# EAGLE design CP Sapling (EAGLE 9.5.2)
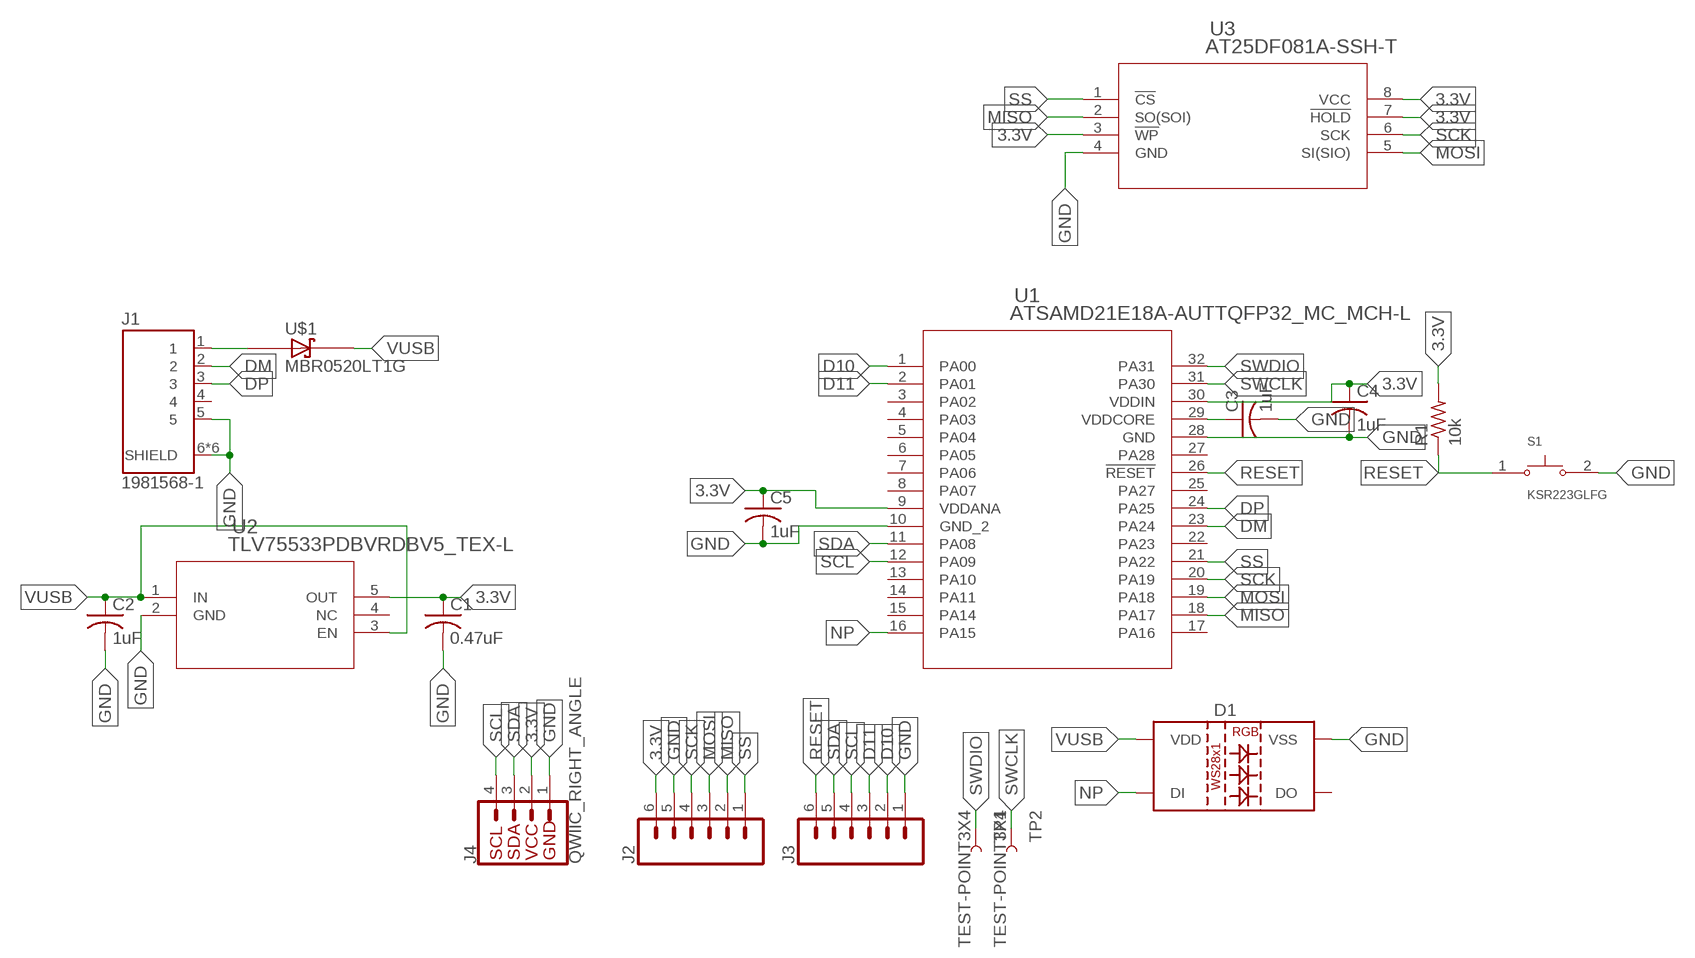
[diagram p0: schematic, sheet 1]

## Parts
C1  0.47uF  C-USC0402  [C0402]
C2  1uF  C-USC0402  [C0402]
C3  1uF  C-USC0402  [C0402]
C4  1uF  C-USC0402  [C0402]
C5  1uF  C-USC0402  [C0402]
D1  WS2812B  WS2812BWS2812B-3535  [WS2812B-3535]
J1  1981568-1  [TE_1981568-1]
J2  CONN_06NO_SILK_NO_POP  [1X06_NO_SILK]
J3  CONN_06NO_SILK_NO_POP  [1X06_NO_SILK]
J4  QWIIC_RIGHT_ANGLE  QWIIC_CONNECTORJS-1MM  [JST04_1MM_RA]
R1  10k  R-US_R0402  [R0402]
S1  KSR223GLFG  [SW_KSR223GLFG]
TP1  TEST-POINT3X4  [PAD.03X.04]
TP2  TEST-POINT3X4  [PAD.03X.04]
U1  ATSAMD21E18A-AUTTQFP32_MC_MCH-L  [TQFP32_MC_MCH-L]
U2  TLV75533PDBVRDBV5_TEX-L  [DBV5_TEX-L]
U3  AT25DF081A-SSH-T  [SOIC_AT25DF081_ADO]
U$1  MBR0520LT1G  [SOD3716X117(SOD-123)]

## Nets
3.3V: C1.1 C4.1 C5.1 J2.6 J4.2 R1.2 U1.9(VDDANA) U1.30(VDDIN) U2.5(OUT) U3.3(!WP) U3.7(!HOLD) U3.8(VCC)
D10: J3.2 U1.1(PA00)
D11: J3.3 U1.2(PA01)
DM: J1.2 U1.23(PA24)
DP: J1.3 U1.24(PA25)
GND: C1.2 C2.2 C3.2 C4.2 C5.2 D1.3(VSS) J1.5 J1.6(SHIELD) J1.7(SHIELD) J1.8(SHIELD) J1.9(SHIELD) J1.10(SHIELD) J1.11(SHIELD) J2.5 J3.1 J4.1 S1.2 U1.10(GND_2) U1.28(GND) U2.2(GND) U3.4(GND)
MISO: J2.2 U1.18(PA17) U3.2(SO(SOI))
MOSI: J2.3 U1.19(PA18) U3.5(SI(SIO))
N$1: J1.1 U$1.2(A)
N$4: C3.1 U1.29(VDDCORE)
NP: D1.4(DI) U1.16(PA15)
RESET: J3.6 R1.1 S1.1 U1.26(!RESET)
SCK: J2.4 U1.20(PA19) U3.6(SCK)
SCL: J3.4 J4.4 U1.12(PA09)
SDA: J3.5 J4.3 U1.11(PA08)
SS: J2.1 U1.21(PA22) U3.1(!CS)
SWCLK: TP2.P$1 U1.31(PA30)
SWDIO: TP1.P$1 U1.32(PA31)
VUSB: C2.1 D1.1(VDD) U2.1(IN) U2.3(EN) U$1.1(C)
Unconnected: D1.2(DO) J1.4 U1.3(PA02) U1.4(PA03) U1.5(PA04) U1.6(PA05) U1.7(PA06) U1.8(PA07) U1.13(PA10) U1.14(PA11) U1.15(PA14) U1.17(PA16) U1.22(PA23) U1.25(PA27) U1.27(PA28) U2.4(NC)

## Library data of the parts
C1-C5 = rcl:C-US: CAPACITOR, American symbol; SPICEPREFIX: C
D1 = SparkFun-LED:WS2812B: WS2812B SMD addressable RGB LED 5x5mm SMD LED with built-in controller IC. Color: Red/Green/Blue mC Rating: RGB: 390, 660, 180 mcd Forward Voltage: RGB: 2.0, 3.0, 3.0 V Packages:WS2812B SparkFun Products: Blynk Board - ESP8266 <https://www.sparkfun.com/products/13794>
J1 = 1981568-1:1981568-1: CONN RCPT MICRO USB B R/A SMD; AVAILABILITY: Unavailable; DESCRIPTION: USB - micro B USB 2.0 Receptacle Connector 5 Position Surface Mount, Right Angle; MF: TE Connectivity; MP: 19815681; PACKAGE: None; PRICE: None; TE_PURCHASE_URL: https://www.te.com/usa-en/product-19815681.html?te_bu=Cor&te_type=disp&te_campaign=seda_glo_cor-seda-global-disp-prtnr-fy19-seda-model-bom-cta_sma-317_1&elqCampaignId=32493
J2 J3 = SparkFun-Connectors:CONN_06: Multi connection point. Often used as Generic Header-pin footprint for 0.1 inch spaced/style header connections On any of the 0.1 inch spaced packages, you can populate with these: Break Away Headers - Straight <https://www.sparkfun.com/products/116> (PRT-00116) Break Away Male Headers - Right Angle <https://www.sparkfun.com/products/553> (PRT-00553) Female Headers <https://www.sparkfun.com/products/115> (PRT-00115) Break Away Headers - Machine Pin <https://www.sparkfun.com/products/117> (PRT-00117) Break Away Female Headers - Swiss Machine Pin <https://www.sparkfun.com/products/743> (PRT-00743) Arduino Stackable Header - 6 Pin <https://www.sparkfun.com/products/9280> (PRT-09280) For SCREWTERMINALS and SPRING TERMINALS visit here: Screw Terimnals on SparkFun.com <https://www.sparkfun.com/search/results?term=Screw+Terminals> (5mm/3.5mm/2.54mm spacing) This device is also useful as a general connection point to wire up your design to another part of your project. Our various solder wires solder well into these plated through hole pads. Hook-Up Wire - Assortment (Stranded, 22 AWG) <https://www.sparkfun.com/products/11375> (PRT-11375) Hook-Up Wire - Assortment (Solid Core, 22 AWG) <https://www.sparkfun.com/products/11367> (PRT-11367) View the entire wire category on our website here <https://www.sparkfun.com/categories/141>
J4 = SparkFun-Connectors:QWIIC_CONNECTOR: SparkFun I2C Standard Qwiic Connector An SMD 1mm pitch JST connector makes it easy and quick (get it? Qwiic?) to connect I2C devices to each other. The Qwiic system <http://www.sparkfun.com/qwiic> enables fast and solderless connection between popular platforms and various sensors and actuators. We carry 200mm <https://www.sparkfun.com/products/14204>, 100mm <https://www.sparkfun.com/products/14205>, 50mm <https://www.sparkfun.com/products/14206>, and breadboard friendly <https://www.sparkfun.com/products/14207> Qwiic cables. We also offer 10 pcs strips <https://www.sparkfun.com/products/14323> the SMD connectors.; PROD_ID: CONN-13694
R1 = rcl:R-US_: RESISTOR, American symbol; SPICEPREFIX: R
S1 = KSR223GLFG:KSR223GLFG: Switch Tactile N.O. SPST Round Button Gull Wing 0.01A 32VDC 0.2VA 200000Cycles 2N SMD Automotive T/R; AVAILABILITY: Unavailable; DESCRIPTION: Tactile Switch SPST-NO Top Actuated Surface Mount; MF: C&K; MP: KSR223GLFG; PACKAGE: None; PRICE: None
TP1 TP2 = SparkFun-Connectors:TEST-POINT: SparkFun Test Points Bare copper test points for troubleshooting or In-Circuit-Testing. These are used by our Production team for verifying production board runs using pogo-pins on test beds. SparkFun Products: SparkFun LSM9DS1 Breakout <https://www.sparkfun.com/products/13284> SparkFun PSOC <https://www.sparkfun.com/products/13714> SparkFun Load Cell Amplifier <https://www.sparkfun.com/products/13879>
U1 = ATSAMD21E18A-AUT:ATSAMD21E18A-AUT; BUILT_BY: EMA_Molly; COPYRIGHT: Copyright (C) 2018 Accelerated Designs. All rights reserved; MANUFACTURER_PART_NUMBER: ATSAMD21E18A-AUT; SOURCELIBRARY: Microchip_2019-08-23_25; VENDOR: Microchip
U2 = TLV75533pdbvr:TLV75533PDBVR; COPYRIGHT: Copyright (C) 2018 Accelerated Designs. All rights reserved; MANUFACTURER_PART_NUMBER: TLV75533PDBVR; SOURCELIBRARY: TI_2019-06-18; VENDOR: Texas Instruments
U3 = AT25DF081A-SSH-T:AT25DF081A-SSH-T; BUILT_BY: EMA_Matt; COPYRIGHT: Copyright (C) 2018 Accelerated Designs. All rights reserved; MANUFACTURER_PART_NUMBER: AT25DF081A-SSH-T; SOURCELIBRARY: Adesto_Technologies_10-16-2019; VENDOR: Adesto Technologies
U$1 = MBR0520LT1G:MBR0520LT1G: Surface Mount Schottky Power Rectifier Plastic SOD−123 Package; AVAILABILITY: Unavailable; DESCRIPTION: Diode Schottky 20V 500mA Surface Mount SOD-123; MF: ON Semiconductor; MP: MBR0520LT1G; PACKAGE: SOD-123 ON Semiconductor; PRICE: None

## Board
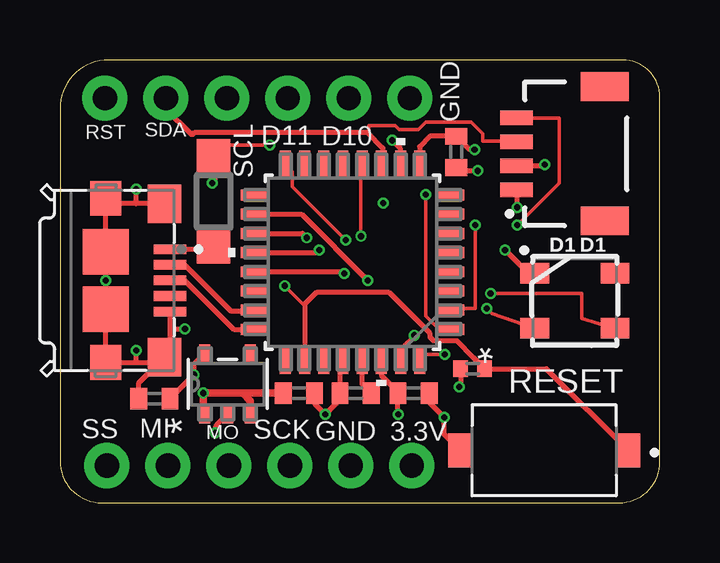
[diagram p1: board, top side]
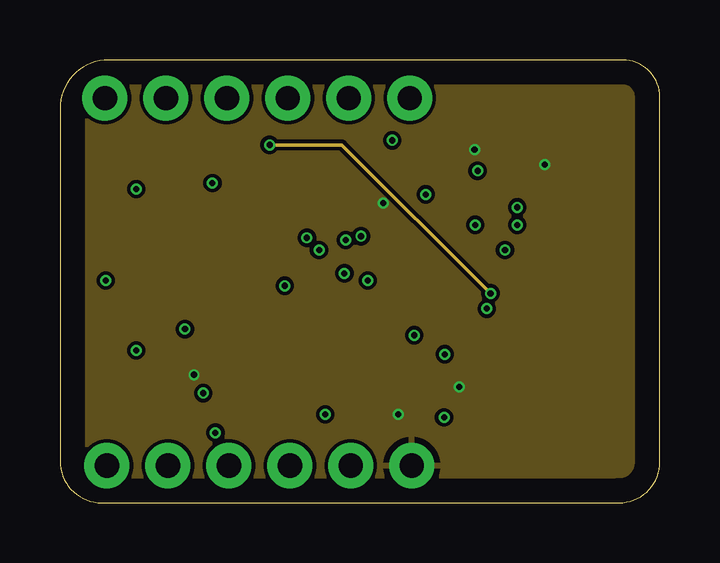
[diagram p2: board, inner layer Route2]
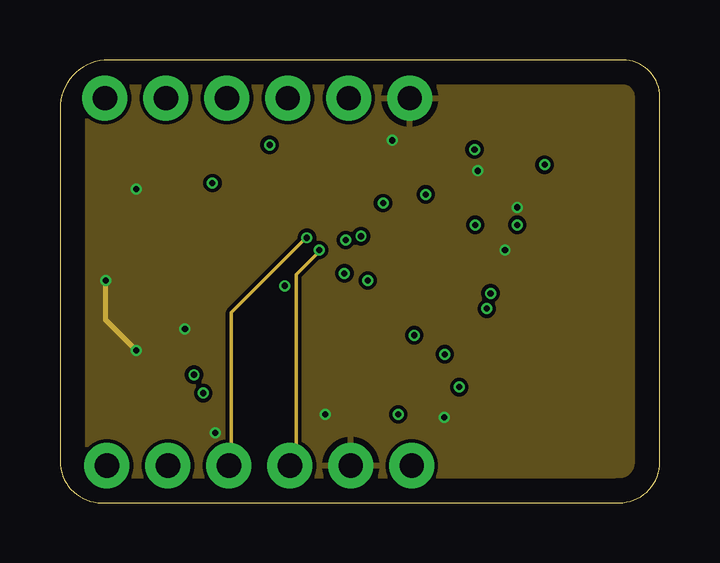
[diagram p3: board, inner layer Route15]
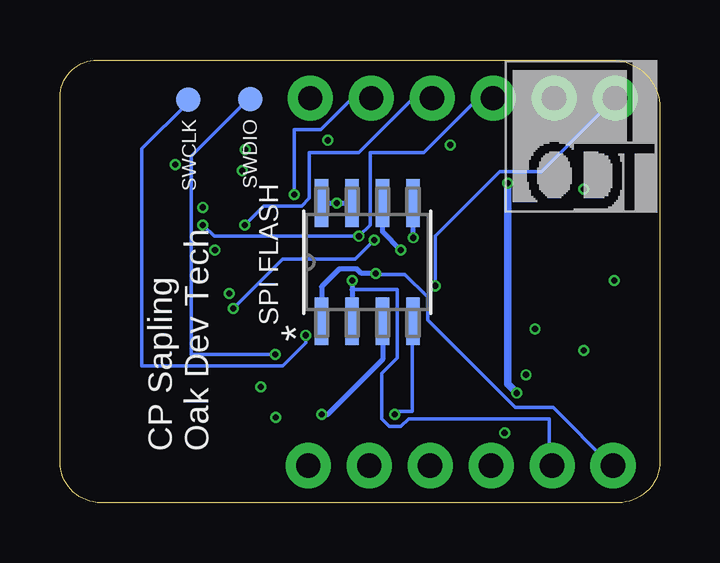
[diagram p4: board, bottom side, seen from below]

Size 25 x 18.47 mm. Coordinates in mm from the lower left corner, seen from the top.
Outline: 0,16.44 0,1.73 arc90 1.73,0 23.3,0 arc90 25,1.7 25,16.91 arc90 23.44,18.47 2.03,18.47 arc90 0,16.44
Copper layers (1+2*15+16): Top 0.035mm / dielectric 1.5mm / Route2 0.035mm / dielectric 0.15mm / Route15 0.035mm / dielectric 0.2mm / Bottom 0.035mm
Design rules "default *": minimum track width 6mil, minimum drill 10mil, track to track 6mil, track to pad 6mil, pad to pad 6mil, via to via 6mil, smd to smd 6mil, copper to edge 40mil, drill to drill 6mil, minimum pad ring 10mil, minimum via ring 4mil, stop-mask expansion 4mil, vias tented up to drill 20mil, thermal gap 10mil

### Footprints (pad centres in the part's own frame; a part is rotated, then mirrored left to right if it is on the bottom)
C0402 = smd 0.7 x 0.9: 1 -0.65,0; 2 0.65,0
WS2812B-3535 = smd 1.2 x 0.85: 1 0.923,-0.4; 2 0.923,1.9; 3 -2.423,1.9; 4 -2.423,-0.4
TE_1981568-1 = smd 0.4 x 1.35: 1 -1.3,2.675; 2 -0.65,2.675; 3 0,2.675; 4 0.65,2.675; 5 1.3,2.675 | smd 1.6 x 1.4: 6 -3.2,2.45; 7 3.2,2.45 | smd 1.45 x 1.3: 8 3.425,0; 9 -3.425,0 | smd 1.9 x 1.9: 10 -1.2,0; 11 1.2,0
1X06_NO_SILK = drill 1.016 pad 1.88: 1 0,0; 2 2.54,0; 3 5.08,0; 4 7.62,0; 5 10.16,0; 6 12.7,0
JST04_1MM_RA = smd 0.6 x 1.35: 1 -1.5,0; 2 -0.5,0; 3 0.5,0; 4 1.5,0 | smd 1.2 x 2: NC1 2.8,-3.675; NC2 -2.8,-3.675
R0402 = smd 0.6 x 0.7: 1 -0.5,0; 2 0.5,0
SW_KSR223GLFG = smd 1 x 1.4: 1 -3.5,0; 2 3.5,0
PAD.03X.04 = smd 1.016 x 1.016: P$1 0,0
TQFP32_MC_MCH-L = smd 1.168 x 0.457: 1 -4.068,2.8; 2 -4.068,2; 3 -4.068,1.2; 4 -4.068,0.4; 5 -4.068,-0.4; 6 -4.068,-1.2; 7 -4.068,-2; 8 -4.068,-2.8; 17 4.068,-2.8; 18 4.068,-2; 19 4.068,-1.2; 20 4.068,-0.4; 21 4.068,0.4; 22 4.068,1.2; 23 4.068,2; 24 4.068,2.8 | smd 0.457 x 1.168: 9 -2.8,-4.068; 10 -2,-4.068; 11 -1.2,-4.068; 12 -0.4,-4.068; 13 0.4,-4.068; 14 1.2,-4.068; 15 2,-4.068; 16 2.8,-4.068; 25 2.8,4.068; 26 2,4.068; 27 1.2,4.068; 28 0.4,4.068; 29 -0.4,4.068; 30 -1.2,4.068; 31 -2,4.068; 32 -2.8,4.068
DBV5_TEX-L = smd 0.775 x 0.457: 1 -1.264,0.95; 2 -1.264,0; 3 -1.264,-0.95; 4 1.264,-0.95; 5 1.264,0.95
SOIC_AT25DF081_ADO = smd 1.981 x 0.559: 1 -2.464,1.905; 2 -2.464,0.635; 3 -2.464,-0.635; 4 -2.464,-1.905; 5 2.464,-1.905; 6 2.464,-0.635; 7 2.464,0.635; 8 2.464,1.905
SOD3716X117(SOD-123) = smd 1.4 x 1.4: 1 -1.9,0.051; 2 1.9,0.051

### Placement (x,y rotation side)
C1  3.94,4.34 180 top
C2  9.96,4.57 0 top
C3  12.32,4.57 180 top
C4  16.51,14.63 270 top
C5  14.73,4.57 0 top
D1  22.2,7.67 0 top
J1  1.91,9.27 270 top
J2  1.96,1.55 0 top
J3  14.57,16.87 180 top
J4  19.02,14.55 90 top
R1  17.2,5.59 180 top
S1  20.17,2.18 180 top
TP1  17.07,16.84 0 bottom
TP2  19.66,16.81 0 bottom
U1  12.19,10.03 180 top
U2  6.99,4.95 90 top
U3  12.19,10.03 90 bottom
U$1  6.35,12.57 270 top

### Tracks (layer width: path | path; a pad name or v marks a point on that pad's centre or on a via)
3.3V  (via drill 0.25)
  Top 0.203: C1.1 v5.58,5.34 5.58,5.76 U2.5 | U1.30 13.39,5.31 14.08,4.62 C5.1 14.08,3.7 v14.1,3.68 | U1.9 14.99,14.86 15.41,15.28 C4.1 17.06,14.73 v17.27,14.73 | R1.2 16.7,4.88 v16.64,4.83 | J4.2 20.15,14.05 v20.19,14.1
  Bottom 0.203: U3.8 v13.46,12.5 U3.7 | U3.3 11.56,5.97 13.84,3.68 v14.1,3.68
  pour Route2: -2.54,20.32 30.48,20.32 30.48,-2.54 -2.54,-2.54
D10  (via drill 0.25)
  Top 0.152: v15.24,12.86 15.24,7.78 15.72,7.3 16.19,7.3 U1.1
  Bottom 0.152: v15.24,12.86 15.24,15.56 14.13,15.56 12.86,16.83 12.06,16.83 J3.2
D11  (via drill 0.25)
  Top 0.152: v17.3,11.59 17.3,8.1 16.35,8.1 U1.2
  Bottom 0.152: v17.3,11.59 16.51,12.38 14.92,12.38 14.61,12.7 14.61,14.61 12.54,14.61 10.32,16.83 9.53,16.83 J3.3
DM
  Top 0.203: J1.2 5.19,9.92 7.11,8 8.09,8 U1.23
DP
  Top 0.203: J1.3 5.21,9.27 7.25,7.23 U1.24
GND  (via drill 0.25)
  Top 0.203: J1.6 3.17,12.47 | 3.17,12.47 2.13,12.47 2.03,12.57 | 2.03,12.57 J1.9 | 2.03,12.57 1.91,12.45 J1.10 v1.91,9.27 J1.11 J1.8 3.17,5.85 | 3.17,5.85 4.13,5.85 | 4.13,5.85 J1.7 4.58,6.3 4.58,7.24 | J1.5 4.58,7.24 | C1.2 3.29,5 4.13,5.85 | U1.28 11.67,5.84 C3.2 11.67,4.3 v11.05,3.68 10.61,4.12 C2.2 | C4.2 16.65,13.84 v17.4,13.84 | J4.1 19.02,12.34 v19.05,12.32 | v18.54,10.54 19.51,9.57 D1.3 | U1.10 14.19,14.76 v13.84,15.11 | U2.2 6.52,3.22 6.52,3.2 6.48,3.16 v6.48,2.92 | 4.58,7.24 v5.21,7.24 | 3.17,5.85 v3.17,6.35 | 3.17,12.47 v3.17,13.08 | C5.2 15.38,4.18 v16,3.56 16,2.85 S1.2
  Route15 0.203: v3.17,6.35 1.91,7.62 v1.91,9.27
  Bottom 0.152: U3.4 10.32,7.46 10.32,3.81 10.95,3.81 v11.05,3.68
  pour Route15: -1.27,19.05 29.21,19.05 29.21,-1.27 -1.27,-1.27
MISO  (via drill 0.25)
  Top 0.203: U1.18 10.06,12.03 v12.83,9.27
  Bottom 0.152: J2.2 4.6,1.59 4.6,3.49 10.48,3.49 10.79,3.17 11.27,3.17 11.59,3.49 11.59,5.4 10.95,6.03 10.95,8.89 12.83,8.89 12.86,8.89
  Bottom 0.203: v12.83,9.27 12.83,8.89 U3.2
MOSI  (via drill 0.25)
  Top 0.203: U1.19 10.1,11.23 v10.29,11.05
  Route15 0.152: v10.29,11.05 10.16,10.95 7.14,7.94 7.14,1.59 J2.3
  Bottom 0.203: v10.29,11.05 U3.5
N$1
  Top 0.203: J1.1 6.3,10.57 U$1.2
N$4
  Top 0.203: C3.1 12.59,4.95 U1.29
NP  (via drill 0.25)
  Top 0.152: v11.91,10.95 9.68,13.18 9.68,13.81 9.53,13.97 U1.16 | v17.78,8.1 17.99,7.89 D1.4
  Bottom 0.152: v11.91,10.95 12.7,10.16 15.72,10.16 v17.78,8.1
RESET  (via drill 0.25)
  Top 0.152: v9.37,9.05 10.16,8.26 10.19,8.26
  Top 0.203: S1.1 20.26,5.59 R1.1 17.25,6.03 17.25,6.04 16.54,6.75 15.57,6.75 15.42,6.9 15.42,7.06 13.72,8.76 10.67,8.76 10.19,8.29 10.19,8.26 U1.26
  Bottom 0.152: v9.37,9.05 9.37,11.11 6.67,13.81 4.92,13.81 1.91,16.83 J3.6
SCK  (via drill 0.25)
  Top 0.203: U1.20 10.69,10.43 v10.79,10.54
  Route15 0.152: v10.79,10.54 10.79,10.48 9.84,9.53 9.84,1.75 9.68,1.59 J2.4
  Bottom 0.203: v10.79,10.54 11.56,11.3 U3.6
SCL  (via drill 0.25)
  Top 0.152: v12.54,11.11 12.54,13.97 U1.12 | v19.05,11.59 20.8,13.34 20.8,16.03 19.05,16.03 J4.4
  Bottom 0.152: J3.4 6.99,16.83 7.62,16.83 9.84,14.61 12.06,14.61 12.06,11.59 v12.54,11.11 18.57,11.11 v19.05,11.59
SDA
  Top 0.152: J4.3 18.89,15.08 17.62,15.08 17.62,15.4 17.14,15.88 15.24,15.88 14.92,15.56 14.13,15.56 13.97,15.72 12.86,15.72 12.86,15.4 12.82,15.43
  Top 0.203: U1.11 13.46,14.16 13.46,14.79 12.82,15.43 5.6,15.43 5.54,15.37 5.46,15.37 4.41,16.42 J3.5
SS  (via drill 0.25)
  Top 0.203: U1.21 11.78,9.63 v11.85,9.56
  Bottom 0.152: J2.1 2.06,1.59 4.45,3.97 6.03,3.97 9.68,7.62 9.68,8.57 10.64,9.53 11.75,9.53 v11.85,9.56
  Bottom 0.203: v11.85,9.56 12.44,9.56 12.63,9.75 13.36,9.75 14.1,9.02 U3.1
SWCLK  (via drill 0.25)
  Top 0.152: v14.76,6.99 14.29,6.51 14.29,6.03 U1.31
  Bottom 0.152: v14.76,6.99 14.76,6.67 15.72,5.71 21.59,5.71 21.59,14.76 19.68,16.67 TP2.P$1
SWDIO  (via drill 0.25)
  Top 0.152: v16.03,6.19 15.08,6.19 15.08,6.03 U1.32
  Bottom 0.152: v16.03,6.19 19.53,6.19 19.53,14.45 17.14,16.83 TP1.P$1
VUSB  (via drill 0.25)
  Top 0.152: v8.73,14.92 6.85,14.92 U$1.1 | v17.94,8.73 21.75,8.73 21.75,7.69 D1.1
  Top 0.305: U$1.1 6.4,13.39 v6.35,13.34 | U2.1 5.97,3.75 v5.97,4.57 7.62,4.57 | U2.3 7.93,4.26 7.62,4.57 | C2.1 7.62,4.57
  Route2 0.152: v8.73,14.92 11.75,14.92 v17.94,8.73
  Bottom 0.305: v6.35,13.34 6.35,4.95 v5.97,4.57

### Text on the board
tNames: RST | SDA | SCL | D11 | D10 | GND | RESET | SS | MI | MO | SCK | GND | 3.3V
bNames: SWDIO | SWCLK | SPI FLASH | CP Sapling / Oak Dev Tech
_tNames: D1 | D1